# Altium schematic sheet Sheet1 - Pic.SchDoc
size A4
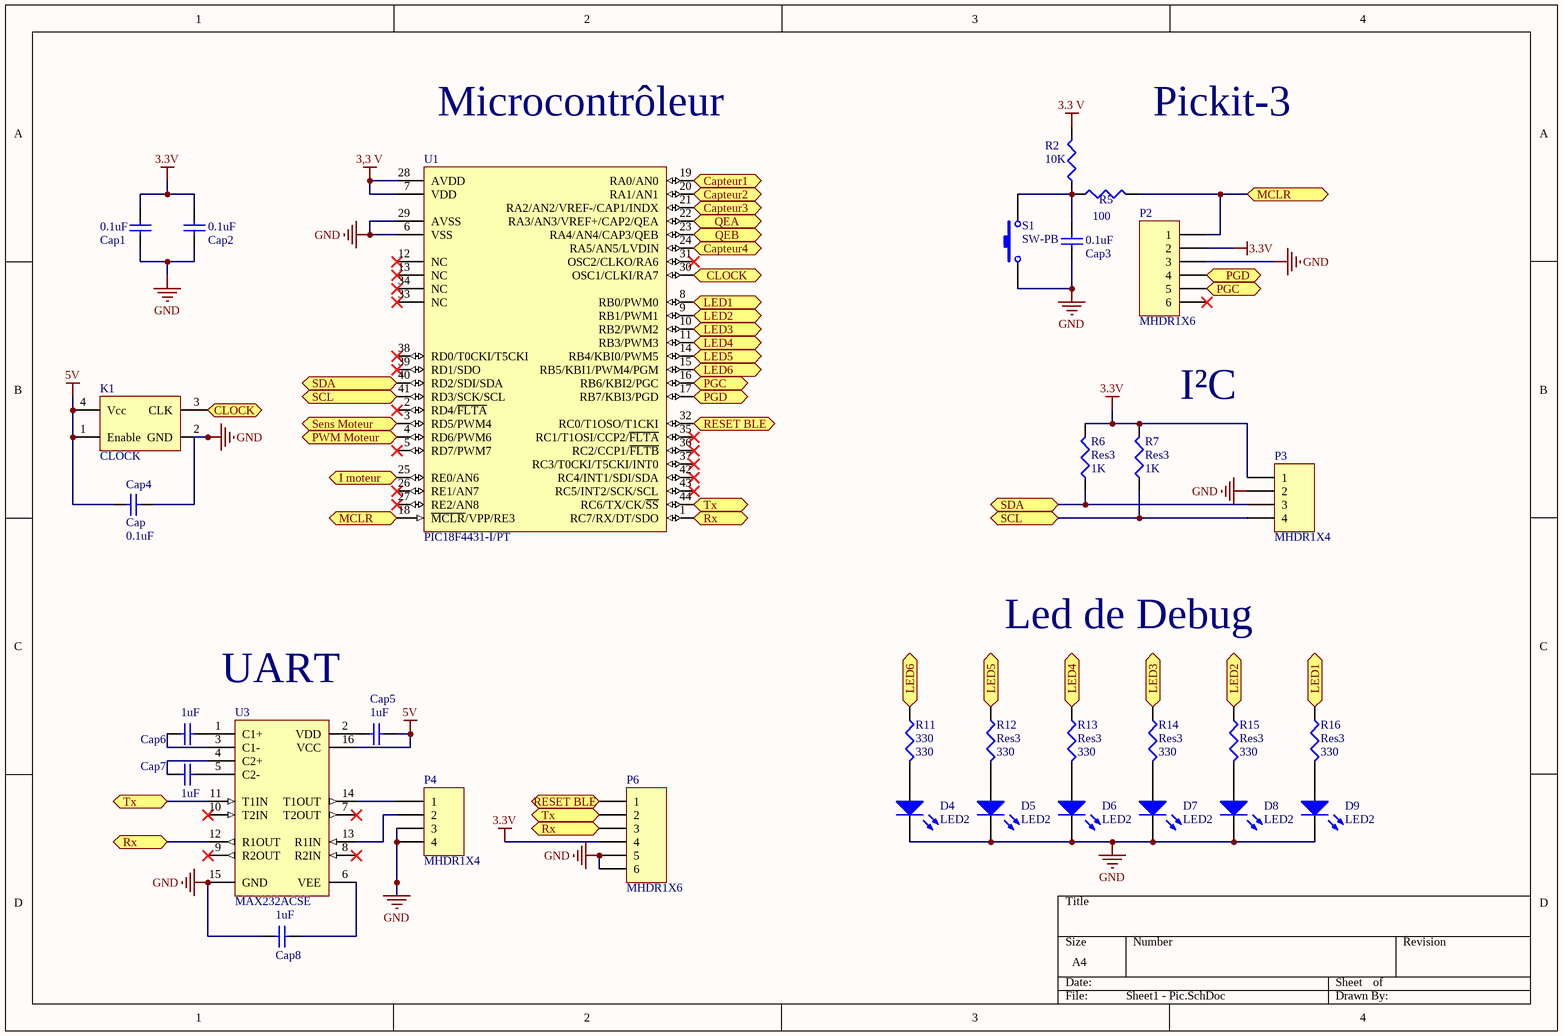
[diagram p0: Sheet1 - Pic.SchDoc]

## Parts
Cap1  0.1uF  [RAD-0.3]
Cap2  0.1uF  [RAD-0.3]
Cap3  0.1uF  [RAD-0.3]
Cap4  Cap  value 0.1uF  [RAD-0.3]
Cap5  1uF  [RAD-0.3]
Cap6  1uF  [RAD-0.3]
Cap7  1uF  [RAD-0.3]
Cap8  1uF  [RAD-0.3]
D4  LED2  [DSO-F2/D6.1]
D5  LED2  [DSO-F2/D6.1]
D6  LED2  [DSO-F2/D6.1]
D7  LED2  [DSO-F2/D6.1]
D8  LED2  [DSO-F2/D6.1]
D9  LED2  [DSO-F2/D6.1]
K1  CLOCK  [IQXO-70]
P2  MHDR1X6  [MHDR1X6]
P3  MHDR1X4  [MHDR1X4]
P4  MHDR1X4  [MHDR1X4]
P6  MHDR1X6  [MHDR1X6]
R2  value 10K  [RESC1608L]  (hidden comment: Res3)
R5  R1: 100  [RESC1608L]
R6  Res3  value 1K  [RESC1608L]
R7  Res3  value 1K  [RESC1608L]
R11  330  [RESC1608L]
R12  Res3  value 330  [RESC1608L]
R13  Res3  value 330  [RESC1608L]
R14  Res3  value 330  [RESC1608L]
R15  Res3  value 330  [RESC1608L]
R16  Res3  value 330  [RESC1608L]
S1  SW-PB  [SPST-2]
U1  PIC18F4431-I/PT  [TQFP-PT44_L]
U3  MAX232ACSE  [NSO16_M]

## Ports
Capteur1 (bidir), Capteur2 (bidir), Capteur3 (bidir), Capteur4 (bidir), CLOCK (bidir), I moteur (bidir), LED1 (bidir), LED2 (bidir), LED3 (bidir), LED4 (bidir), LED5 (bidir), LED6 (bidir), MCLR (bidir), PGC (bidir), PGD (bidir), PWM Moteur (bidir), QEA (bidir), QEB (bidir), RESET BLE (bidir), Rx (bidir), SCL (bidir), SDA (bidir), Sens Moteur (bidir), Tx (bidir)

## Nets
3,3 V: U1.7(VDD) U1.28(AVDD)
3.3 V: R2.2
3.3V: Cap1.2 Cap2.2 P2.2 P3.1 P6.4 R6.2 R7.2
5V: Cap4.1 Cap5.1 K1.1(Enable) K1.4(Vcc) U3.16(VCC)
GND: Cap1.1 Cap2.1 Cap3.1 Cap4.2 Cap8.1 D4.2(K) D5.2(K) D6.2(K) D7.2(K) D8.2(K) D9.2(K) K1.2(GND) P2.3 P3.2 P4.3 P4.4 P6.5 P6.6 S1.1 U1.6(VSS) U1.29(AVSS) U3.15(GND)
Capteur1: U1.19(RA0/AN0) ; port Capteur1
Capteur2: U1.20(RA1/AN1) ; port Capteur2
Capteur3: U1.21(RA2/AN2/VREF-/CAP1/INDX) ; port Capteur3
Capteur4: U1.24(RA5/AN5/LVDIN) ; port Capteur4
CLOCK: K1.3(CLK) U1.30(OSC1/CLKI/RA7) ; port CLOCK
I moteur: U1.25(RE0/AN6) ; port I moteur
LED1: R16.1 U1.8(RB0/PWM0) ; port LED1
LED2: R15.1 U1.9(RB1/PWM1) ; port LED2
LED3: R14.1 U1.10(RB2/PWM2) ; port LED3
LED4: R13.1 U1.11(RB3/PWM3) ; port LED4
LED5: R12.1 U1.14(RB4/KBI0/PWM5) ; port LED5
LED6: R11.1 U1.15(RB5/KBI1/PWM4/PGM) ; port LED6
MCLR: P2.1 R5.2 U1.18(~{MCLR}/VPP/RE3) ; port MCLR
PGC: P2.5 U1.16(RB6/KBI2/PGC) ; port PGC
PGD: P2.4 U1.17(RB7/KBI3/PGD) ; port PGD
PWM Moteur: U1.4(RD6/PWM6) ; port PWM Moteur
QEA: U1.22(RA3/AN3/VREF+/CAP2/QEA) ; port QEA
QEB: U1.23(RA4/AN4/CAP3/QEB) ; port QEB
RESET BLE: P6.1 U1.32(RC0/T1OSO/T1CKI) ; port RESET BLE
Rx: P6.3 U1.1(RC7/RX/DT/SDO) U3.12(R1OUT) ; port Rx
SCL: P3.4 R7.1 U1.41(RD3/SCK/SCL) ; port SCL
SDA: P3.3 R6.1 U1.40(RD2/SDI/SDA) ; port SDA
Sens Moteur: U1.3(RD5/PWM4) ; port Sens Moteur
Tx: P6.2 U1.44(RC6/TX/CK/~{SS}) U3.11(T1IN) ; port Tx
NetCap3_2: Cap3.2 R2.1 R5.1 S1.2
NetCap5_2: Cap5.2 U3.2(VDD)
NetCap6_1: Cap6.1 U3.1(C1+)
NetCap6_2: Cap6.2 U3.3(C1-)
NetCap7_1: Cap7.1 U3.5(C2-)
NetCap7_2: Cap7.2 U3.4(C2+)
NetCap8_2: Cap8.2 U3.6(VEE)
NetD4_1: D4.1(A) R11.2
NetD5_1: D5.1(A) R12.2
NetD6_1: D6.1(A) R13.2
NetD7_1: D7.1(A) R14.2
NetD8_1: D8.1(A) R15.2
NetD9_1: D9.1(A) R16.2
NetP4_1: P4.1 U3.14(T1OUT)
NetP4_2: P4.2 U3.13(R1IN)

Not connected (* = marked no-connect by the designer): P2 6*; U1 2(RD4/~{FLTA})* 5(RD7/PWM7)* 12(NC)* 13(NC)* 26(RE1/AN7)* 27(RE2/AN8)* 31(OSC2/CLKO/RA6)* 33(NC)* 34(NC)* 35(RC1/T1OSI/CCP2/~{FLTA})* 36(RC2/CCP1/~{FLTB})* 37(RC3/T0CKI/T5CKI/INT0)* 38(RD0/T0CKI/T5CKI)* 39(RD1/SDO)* 42(RC4/INT1/SDI/SDA)* 43(RC5/INT2/SCK/SCL)*; U3 7(T2OUT)* 8(R2IN)* 9(R2OUT)* 10(T2IN)*

## Notes on the sheet
- Microcontrôleur
- Pickit-3
- I²C
- Led de Debug
- UART

## Library data of the parts
Cap1-Cap8 = Cap: Capacitor; Published: 8-Jun-2000; LatestRevisionDate: 17-Jul-2002; LatestRevisionNote: Re-released for DXP Platform.; PackageReference: RAD-0.3; Publisher: Altium Limited
D4-D9 = LED2: Typical RED, GREEN, YELLOW, AMBER GaAs LED; Published: 8-Jun-2000; LatestRevisionDate: 17-Jul-2002; LatestRevisionNote: Re-released for DXP Platform.; PackageVersion: Feb-2002; PackageReference: 3.2X1.6X1.1; Publisher: Altium Limited
K1 = OSCILLATEUR: Oscillateur quartz
P2 P6 = MHDR1X6: Header, 6-Pin; LatestRevisionDate: 17-Jul-2002; LatestRevisionNote: Re-released for DXP Platform.; Publisher: Altium Limited
P3 P4 = MHDR1X4: Header, 4-Pin; LatestRevisionDate: 17-Jul-2002; LatestRevisionNote: Re-released for DXP Platform.; Publisher: Altium Limited
R2 R5-R7 R11-R16 = Res3: Resistor; Published: 8-Jun-2000; LatestRevisionDate: 29-May-2009; LatestRevisionNote: IPC-7351 Footprint Added.; PackageReference: J1-0603; Publisher: Altium Limited; PackageDescription: Chip Resistor
  R11: Value: 330
S1 = SW-PB: Switch; Published: 24-Mar-1999; LatestRevisionDate: 17-Jul-2002; LatestRevisionNote: Re-released for DXP Platform.; PackageReference: SPST-2; Publisher: Altium Limited
U1 = PIC18F4431-I/PT: Enhanced Flash Microcontroller with nanoWatt Technology, High Performance PWM and A/D, 16K Flash, 44-Pin TQFP, Industrial Temperature; FirstPublished: 11-Oct-2004; LatestRevisionDate: 29-Jan-2009; LatestRevisionNote: Sch. layout revised. 3D Model Removed.; DatasheetVersion: revC, Jul-2007; PackageVersion: revBB, Aug-2009; PackageReference: TQFP-PT44; Publisher: Altium Limited; PackageDescription: 44-Lead Plastic Thin Quad Flatpack (PT) - 10x10x1mm Body, 2.00mm [TQFP]; Supplier 1: Digi-Key; Supplier Part Number 1: PIC18F4431-I/PT-ND; Supplier 2: Farnell; Supplier Part Number 2: 1137346; Supplier 3: Farnell; Supplier Part Number 3: 1137420; Supplier 4: Farnell; Supplier Part Number 4: 1528308; Supplier 5: Newark; Supplier Part Number 5: 61K3473; Code_JEDEC: MS-026; ComponentLink1Description: Datasheet; ComponentLink1URL: http://ww1.microchip.com/downloads/en/DeviceDoc/39616C.pdf; ComponentLink2Description: Packaging Specification; ComponentLink2URL: http://www.microchip.com/stellent/groups/techpub_sg/documents/packagingspec/en012702.pdf; ComponentLink3Description: Microchip.com Home; ComponentLink3URL: http://www.microchip.com/
U3 = MAX232ACSE: +5V Powered, Multi-Channel RS-232 Driver/Receiver; Published: 16-Jan-2001; LatestRevisionDate: 13-Apr-2006; LatestRevisionNote: IPC-7351 Footprint Added.; PackageReference: NSO16; Publisher: Altium Limited; PackageDescription: 16-Pin Small Outline Integrated Circuit 1.27 mm Pitch; Code_JEDEC: MS-012-AC; Code_IPC: SOIC127P600-16; ComponentLink1Description: Manufacturer Link; ComponentLink1URL: http://www.maxim-ic.com/; ComponentLink2Description: Datasheet; ComponentLink2URL: http://pdfserv.maxim-ic.com/en/ds/MAX220-MAX249.pdf